# Altium schematic sheet quantum-switch-control-panel.SchDoc
size B; SheetNumber: 1; SheetTotal: 1
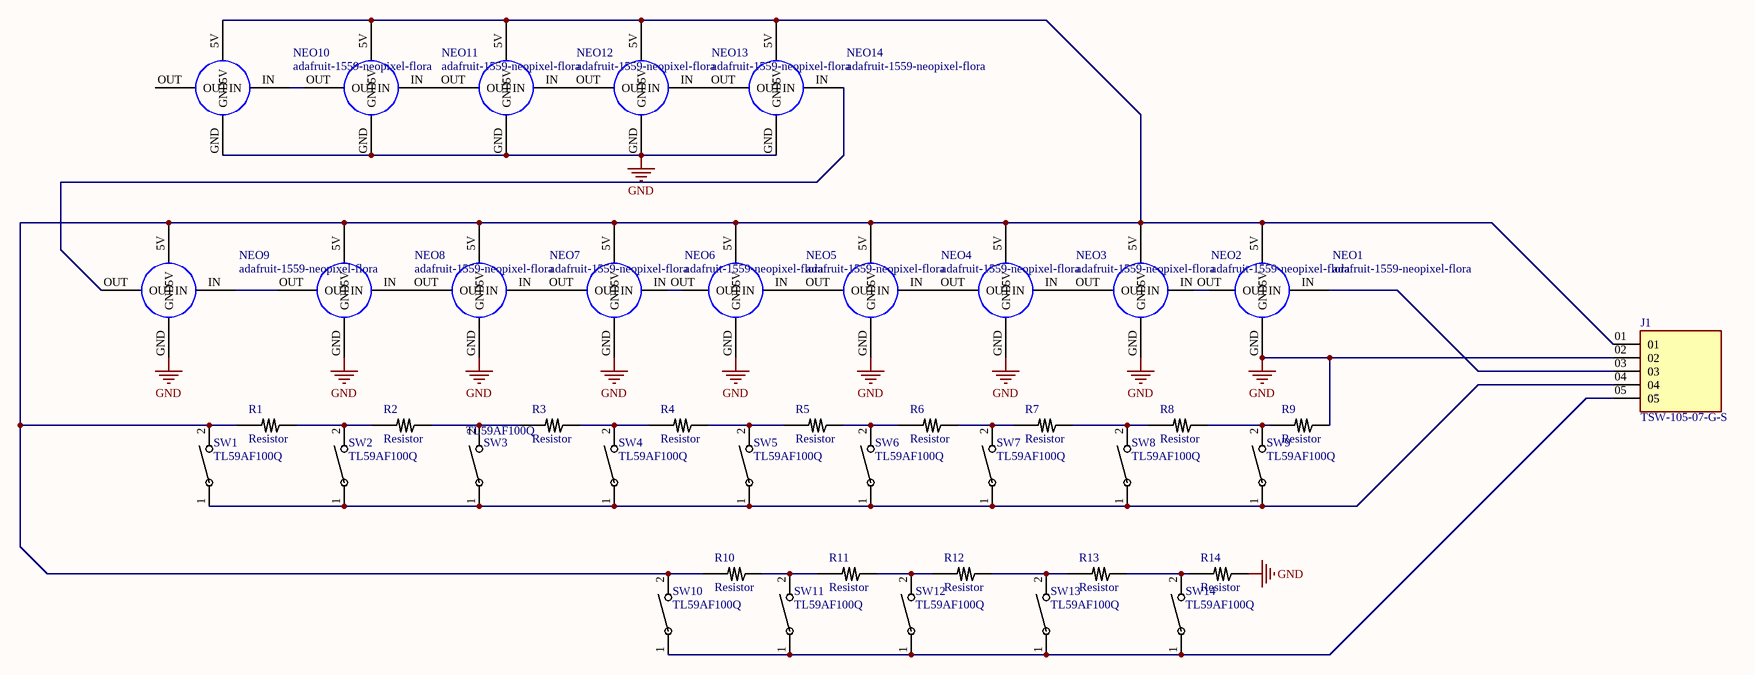
[diagram p0: quantum-switch-control-panel.SchDoc]

## Parts
J1  TSW-105-07-G-S  [SAMTEC_TSW-105-07-G-S]
NEO1  adafruit-1559-neopixel-flora  [adafruit-1559-neopixel-flora]
NEO2  adafruit-1559-neopixel-flora  [adafruit-1559-neopixel-flora]
NEO3  adafruit-1559-neopixel-flora  [adafruit-1559-neopixel-flora]
NEO4  adafruit-1559-neopixel-flora  [adafruit-1559-neopixel-flora]
NEO5  adafruit-1559-neopixel-flora  [adafruit-1559-neopixel-flora]
NEO6  adafruit-1559-neopixel-flora  [adafruit-1559-neopixel-flora]
NEO7  adafruit-1559-neopixel-flora  [adafruit-1559-neopixel-flora]
NEO8  adafruit-1559-neopixel-flora  [adafruit-1559-neopixel-flora]
NEO9  adafruit-1559-neopixel-flora  [adafruit-1559-neopixel-flora]
NEO10  adafruit-1559-neopixel-flora  [adafruit-1559-neopixel-flora]
NEO11  adafruit-1559-neopixel-flora  [adafruit-1559-neopixel-flora]
NEO12  adafruit-1559-neopixel-flora  [adafruit-1559-neopixel-flora]
NEO13  adafruit-1559-neopixel-flora  [adafruit-1559-neopixel-flora]
NEO14  adafruit-1559-neopixel-flora  [adafruit-1559-neopixel-flora]
R1  Resistor  [thruhole resistor]
R2  Resistor  [thruhole resistor]
R3  Resistor  [thruhole resistor]
R4  Resistor  [thruhole resistor]
R5  Resistor  [thruhole resistor]
R6  Resistor  [thruhole resistor]
R7  Resistor  [thruhole resistor]
R8  Resistor  [thruhole resistor]
R9  Resistor  [thruhole resistor]
R10  Resistor  [thruhole resistor]
R11  Resistor  [thruhole resistor]
R12  Resistor  [thruhole resistor]
R13  Resistor  [thruhole resistor]
R14  Resistor  [thruhole resistor]
SW1  TL59AF100Q  [SW_TL59AF100Q_EWI]
SW2  TL59AF100Q  [SW_TL59AF100Q_EWI]
SW3  TL59AF100Q  [SW_TL59AF100Q_EWI]
SW4  TL59AF100Q  [SW_TL59AF100Q_EWI]
SW5  TL59AF100Q  [SW_TL59AF100Q_EWI]
SW6  TL59AF100Q  [SW_TL59AF100Q_EWI]
SW7  TL59AF100Q  [SW_TL59AF100Q_EWI]
SW8  TL59AF100Q  [SW_TL59AF100Q_EWI]
SW9  TL59AF100Q  [SW_TL59AF100Q_EWI]
SW10  TL59AF100Q  [SW_TL59AF100Q_EWI]
SW11  TL59AF100Q  [SW_TL59AF100Q_EWI]
SW12  TL59AF100Q  [SW_TL59AF100Q_EWI]
SW13  TL59AF100Q  [SW_TL59AF100Q_EWI]
SW14  TL59AF100Q  [SW_TL59AF100Q_EWI]

## Nets
GND: J1.02 NEO1.GND NEO2.GND NEO3.GND NEO4.GND NEO5.GND NEO6.GND NEO7.GND NEO8.GND NEO9.GND NEO10.GND NEO11.GND NEO12.GND NEO13.GND NEO14.GND R9.1 R14.1
NetJ1_01: J1.01 NEO1.5V NEO2.5V NEO3.5V NEO4.5V NEO5.5V NEO6.5V NEO7.5V NEO8.5V NEO9.5V NEO10.5V NEO11.5V NEO12.5V NEO13.5V NEO14.5V R1.2 R10.2 SW1.2 SW10.2
NetJ1_03: J1.03 NEO1.IN
NetJ1_04: J1.04 SW1.1 SW2.1 SW3.1 SW4.1 SW5.1 SW6.1 SW7.1 SW8.1 SW9.1
NetJ1_05: J1.05 SW10.1 SW11.1 SW12.1 SW13.1 SW14.1
NetNEO1_OUT: NEO1.OUT NEO2.IN
NetNEO2_OUT: NEO2.OUT NEO3.IN
NetNEO3_OUT: NEO3.OUT NEO4.IN
NetNEO4_OUT: NEO4.OUT NEO5.IN
NetNEO5_OUT: NEO5.OUT NEO6.IN
NetNEO6_OUT: NEO6.OUT NEO7.IN
NetNEO7_OUT: NEO7.OUT NEO8.IN
NetNEO8_OUT: NEO8.OUT NEO9.IN
NetNEO9_OUT: NEO9.OUT NEO14.IN
NetNEO10_IN: NEO10.IN NEO11.OUT
NetNEO11_IN: NEO11.IN NEO12.OUT
NetNEO12_IN: NEO12.IN NEO13.OUT
NetNEO13_IN: NEO13.IN NEO14.OUT
NetR1_1: R1.1 R2.2 SW2.2
NetR2_1: R2.1 R3.2 SW3.2
NetR3_1: R3.1 R4.2 SW4.2
NetR4_1: R4.1 R5.2 SW5.2
NetR5_1: R5.1 R6.2 SW6.2
NetR6_1: R6.1 R7.2 SW7.2
NetR7_1: R7.1 R8.2 SW8.2
NetR8_1: R8.1 R9.2 SW9.2
NetR10_1: R10.1 R11.2 SW11.2
NetR11_1: R11.1 R12.2 SW12.2
NetR12_1: R12.1 R13.2 SW13.2
NetR13_1: R13.1 R14.2 SW14.2

Not connected (* = marked no-connect by the designer): NEO10 OUT

## Library data of the parts
J1 = TSW-105-07-G-S: MF: Samtec Inc.; Package: None; MP: TSW-105-07-G-S; Price: None; Availability: Unavailable; Value: *
SW1-SW14 = TL59AF100Q: No Description Available; Mfr_Name: E-Switch; Copyright: Copyright (C) 2024 Ultra Librarian. All rights reserved.; Manufacturer_Part_Number: TL59AF100Q; RefDes: RefDes; Type: DEV